# EasyEDA schematic SCH_Ouroboros-Loop-Station-rev.0.7_2025-08-07.json

## Sheets
1 Leds: TITLE: Ouroboros Looper / Leds; REV: 0.7; Date: 2025-06-13; Sheet: 2/4; Drawn By: Alex Kulinchenko; Company: WTF
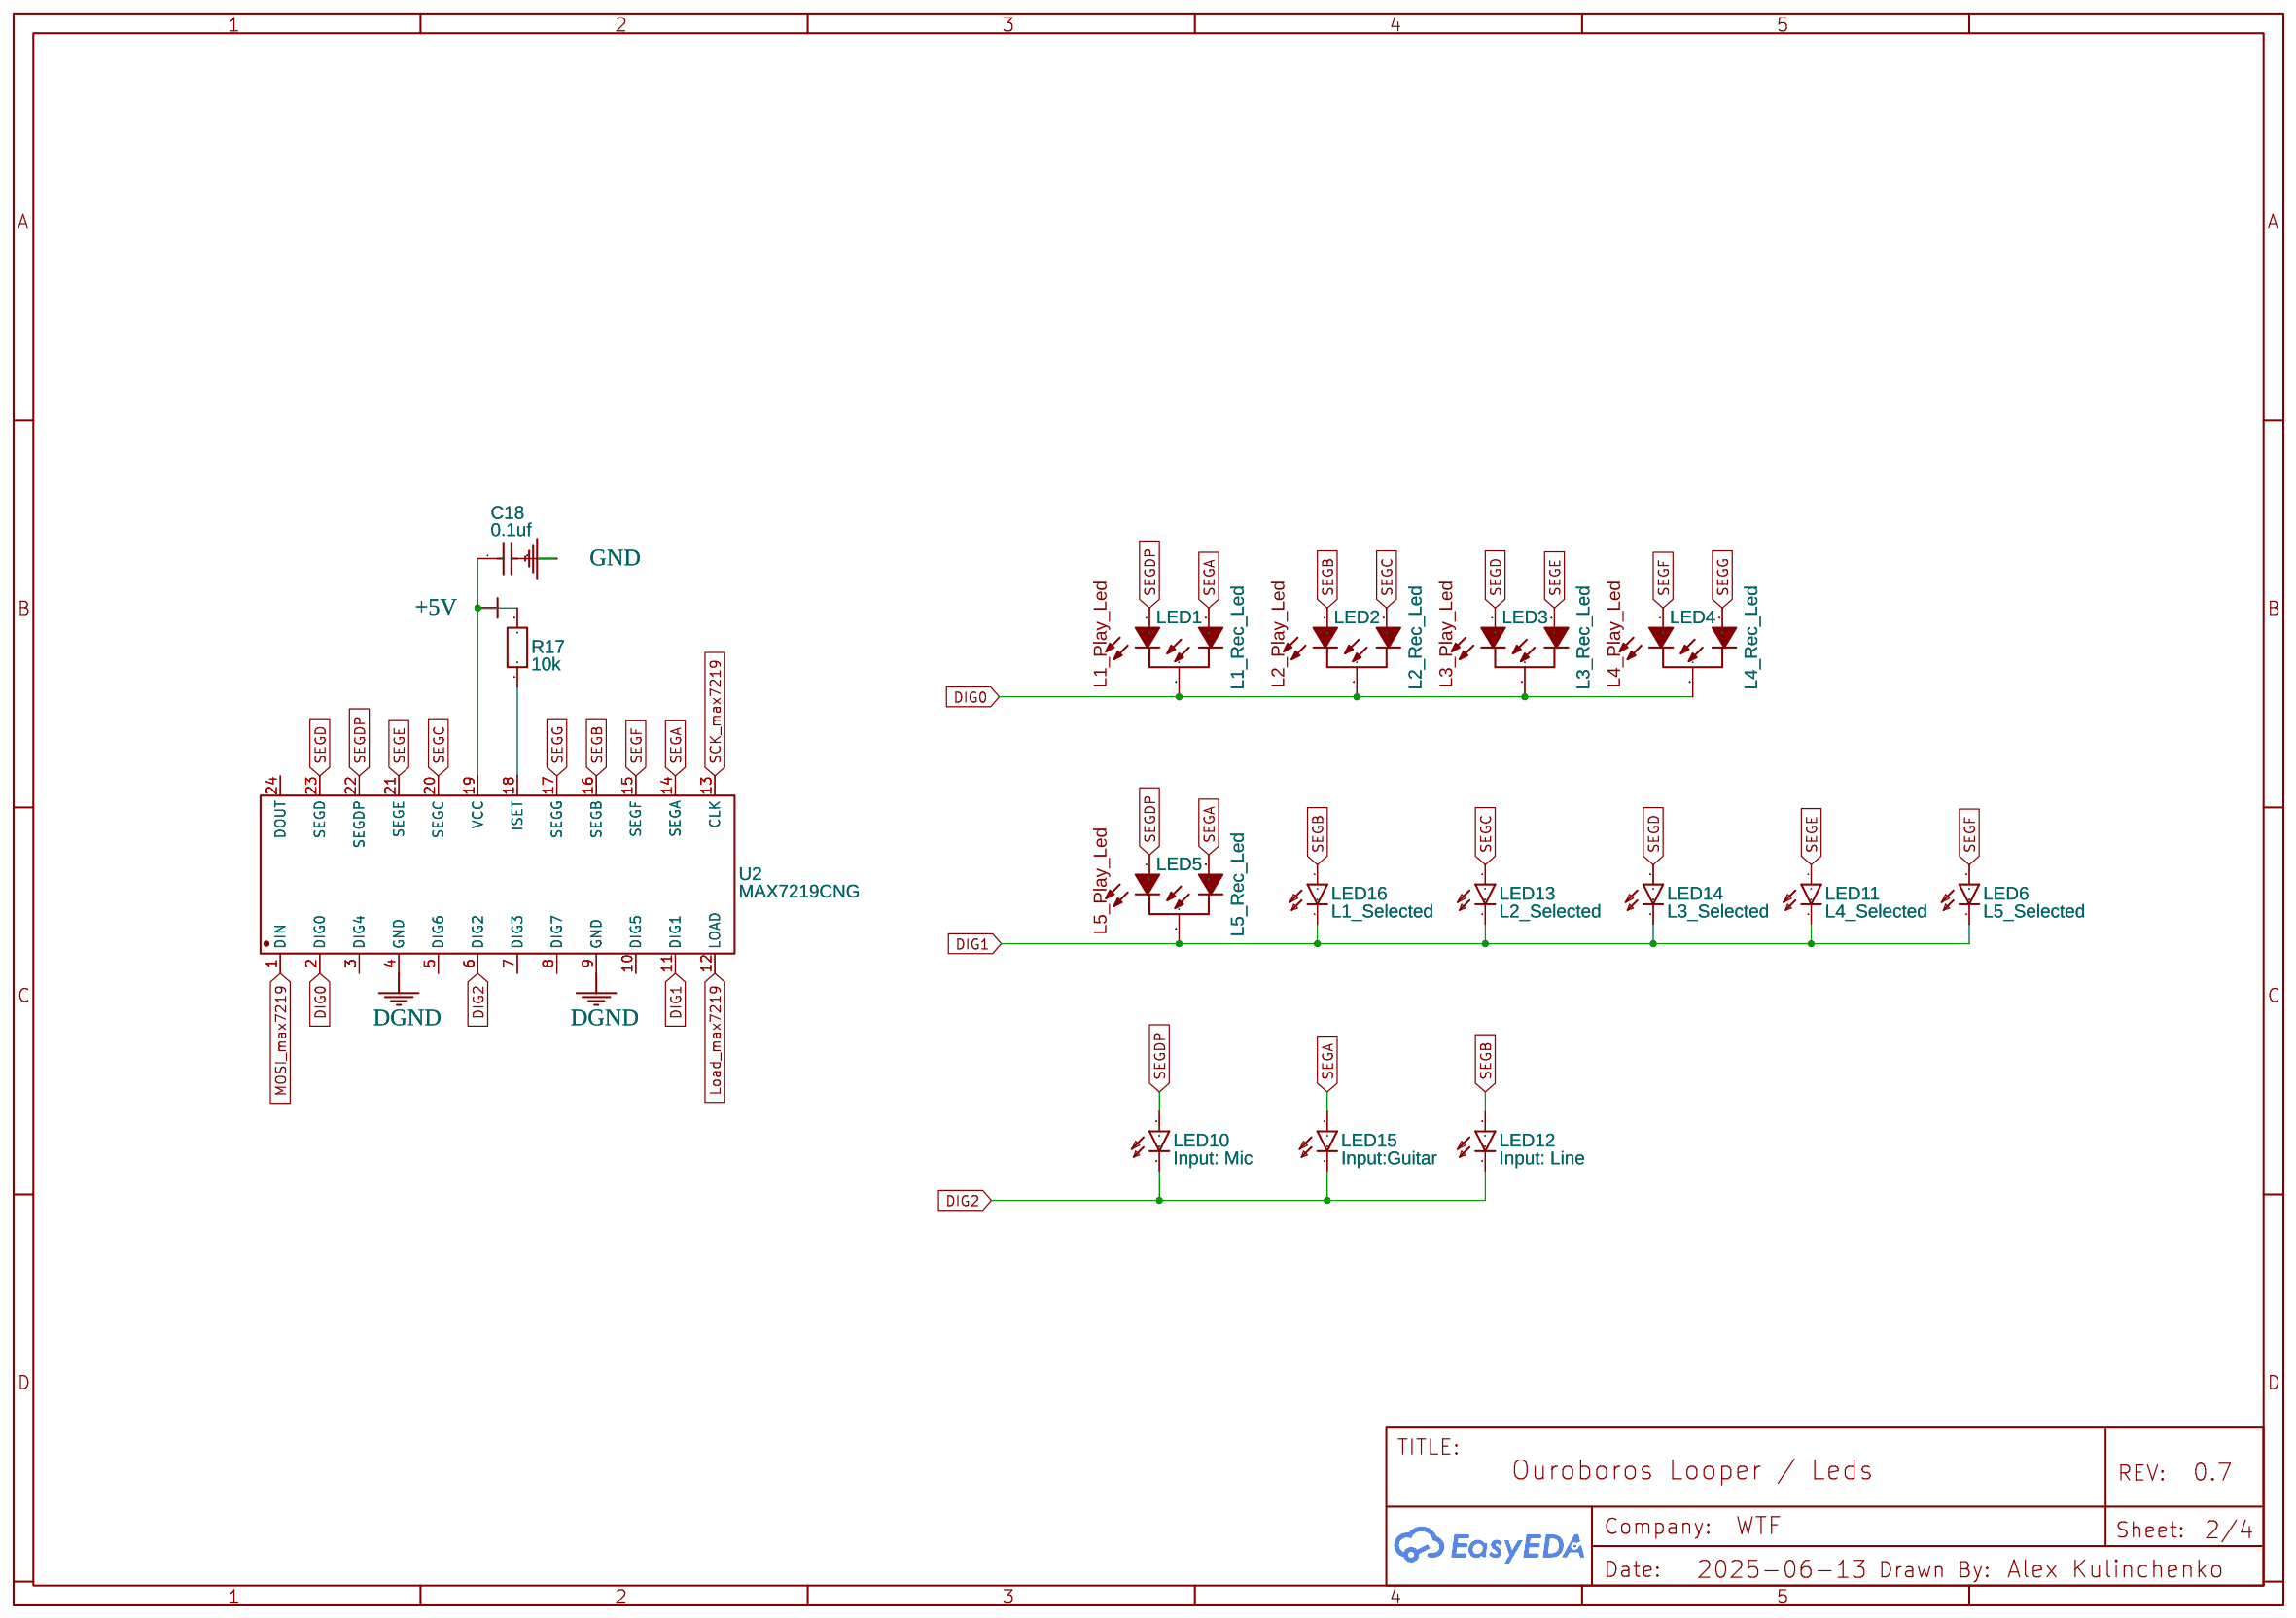
[diagram p0: Leds]
2 In&Out rev.2 copy: TITLE: Ouroboros Looper / In&Out; Date: 2025-06-05; Sheet: 1/4
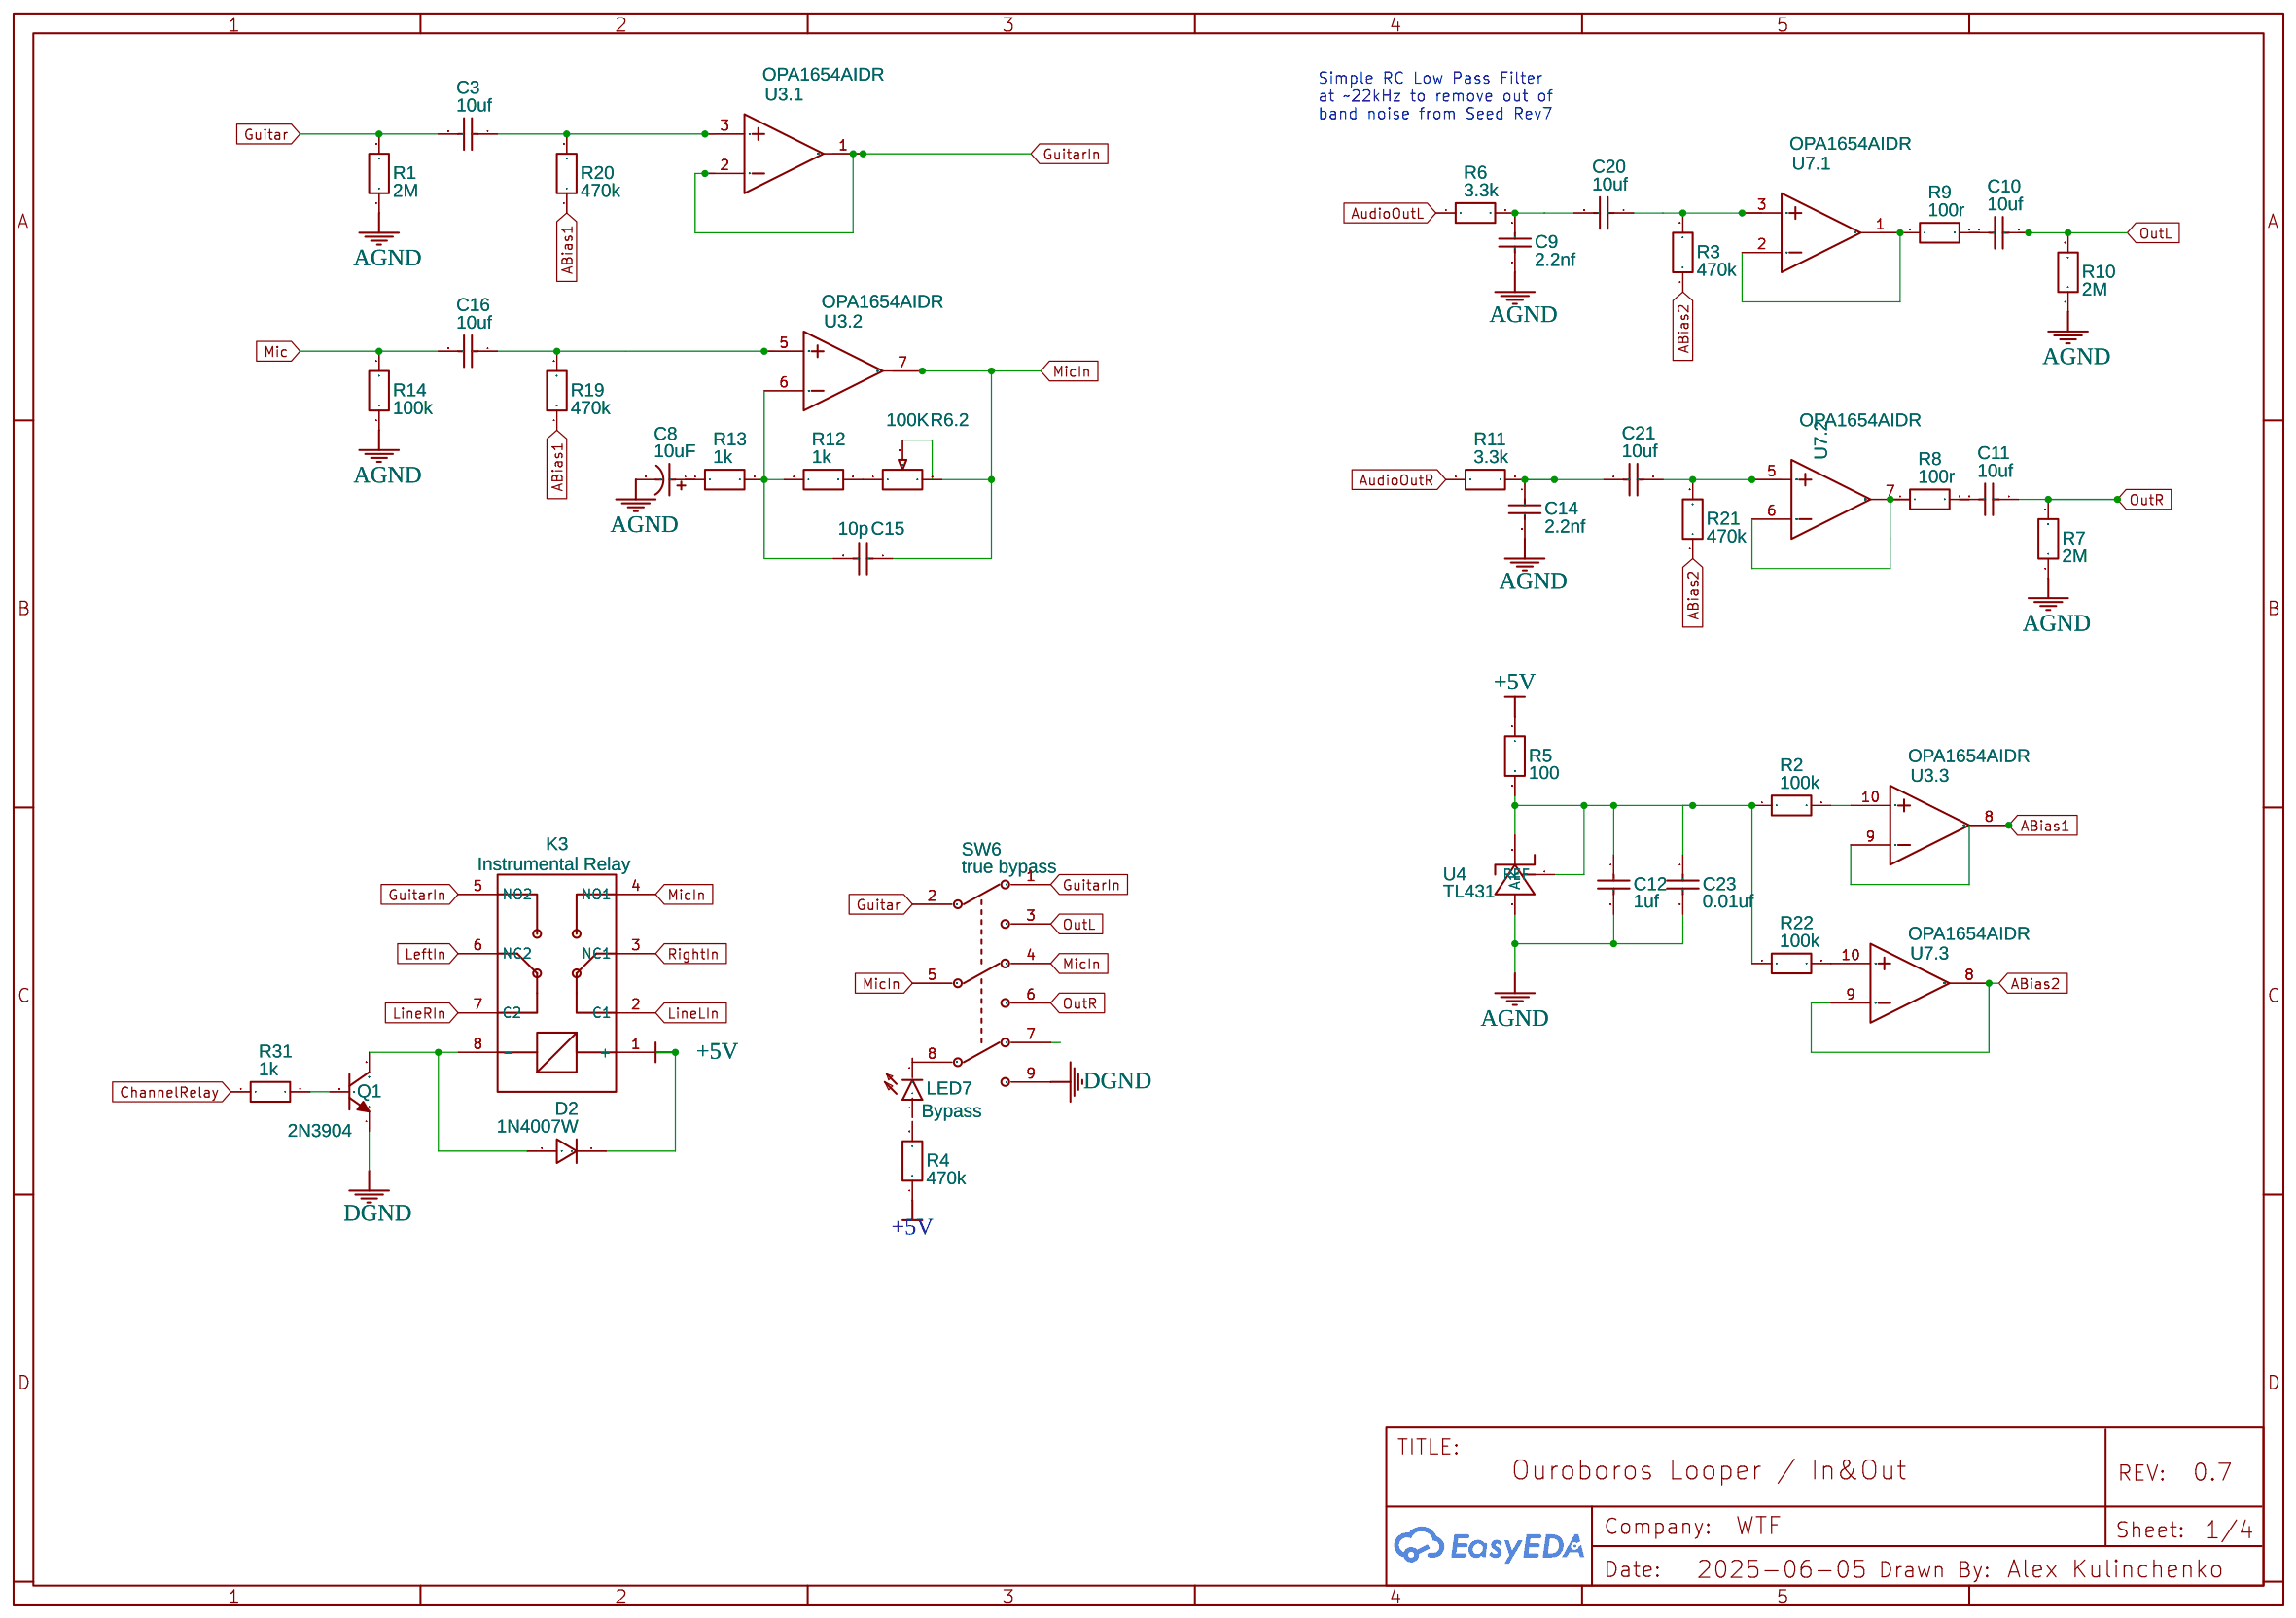
[diagram p1: In&Out rev.2 copy]
3 Main: TITLE: Ouroboros Looper / Daisy; Date: 2025-07-24; Sheet: 1/1; Drawn By: a.kulinchenko; Company: Alex Kulinchenko
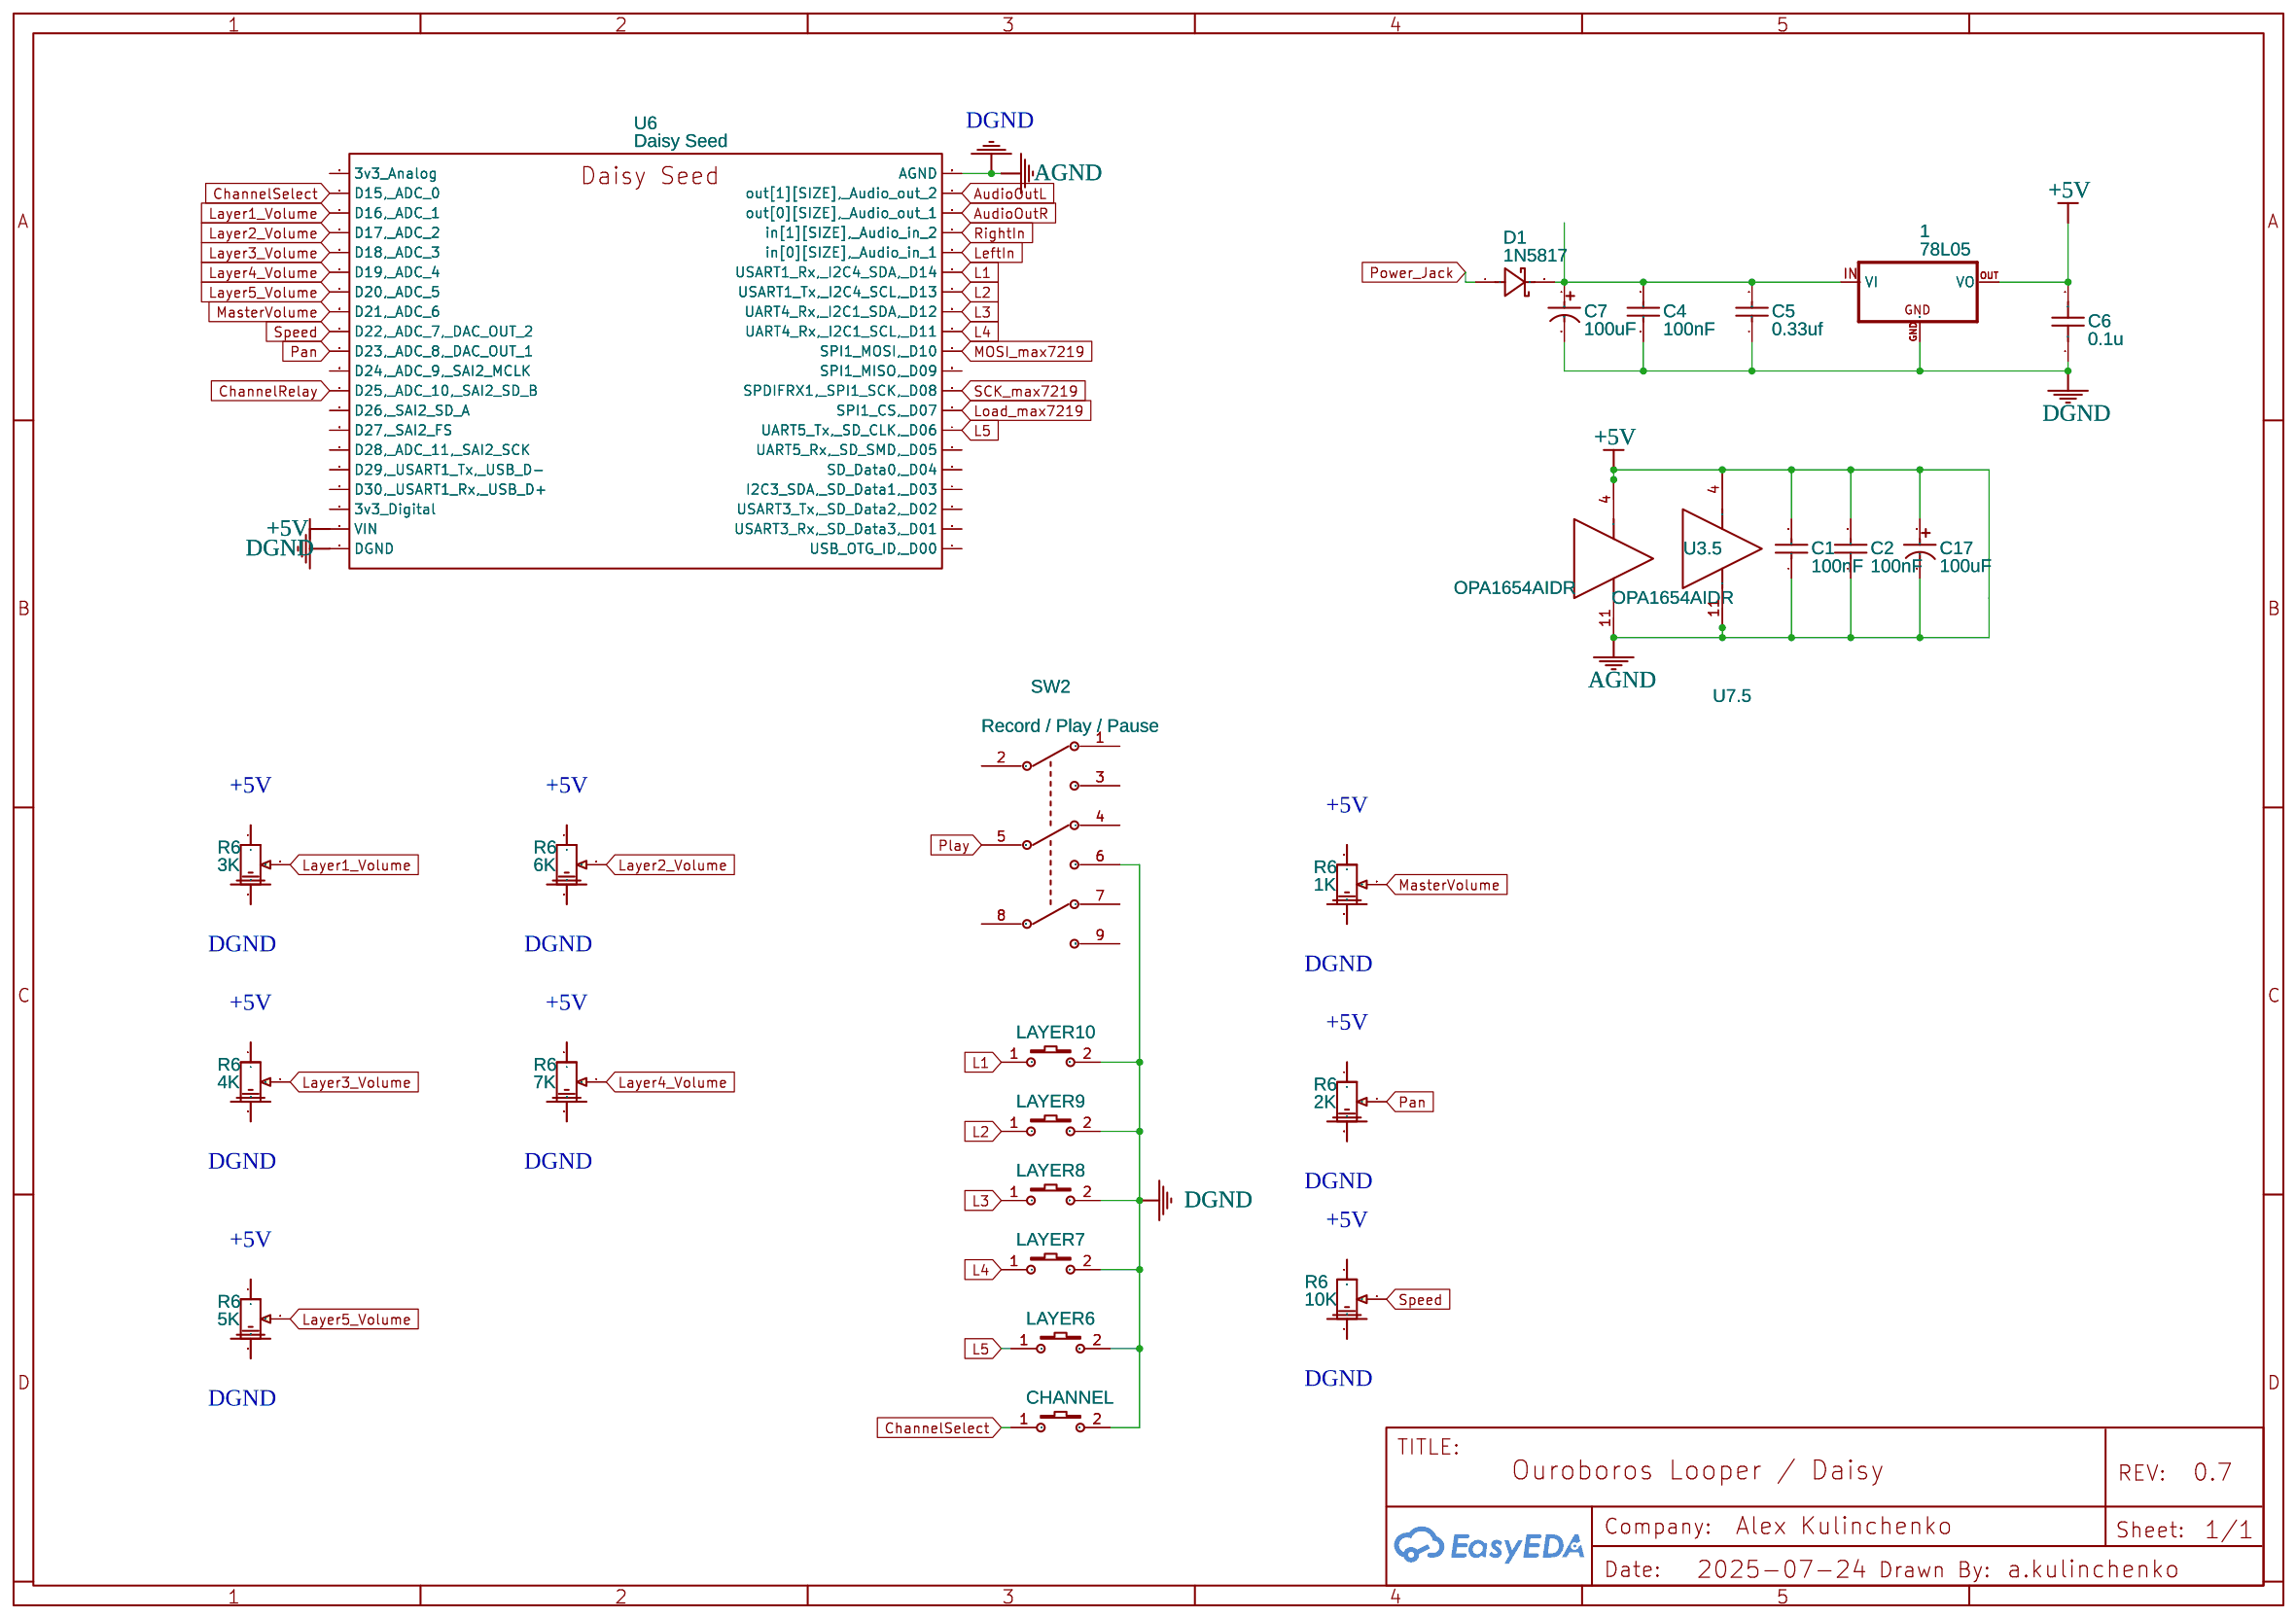
[diagram p2: Main]

## Parts
sheet In&Out rev.2 copy
100K  R6.2  [RES-ADJ-TH_3386P]
C3  10uf  [100NF]
C8  10uF  [CAP10UF SURACHAT]
C9  2.2nf  [100NF]
C10  10uf  [100NF]
C11  10uf  [100NF]
C12  1uf  [100NF]
C14  2.2nf  [100NF]
C15  10p  [100NF]
C16  10uf  [100NF]
C20  10uf  [100NF]
C21  10uf  [100NF]
C23  0.01uf  [100NF]
D2  1N4007W  [SOD-123_L2.8-W1.8-LS3.7-RD]
K3  Instrumental Relay  [G6K-2F-Y OMRON]
LED7  Bypass  [LED_LED3MM]
Q1  2N3904  [TO-92-3_L4.8-W3.7-P1.27-L]
R1  2M  [R_AXIAL-0.4]
R2  100k  [R_AXIAL-0.4]
R3  470k  [R_AXIAL-0.4]
R4  470k  [R_AXIAL-0.4]
R5  100  [R_AXIAL-0.4]
R6  3.3k  [R_AXIAL-0.4]
R7  2M  [R_AXIAL-0.4]
R8  100r  [R_AXIAL-0.4]
R9  100r  [R_AXIAL-0.4]
R10  2M  [R_AXIAL-0.4]
R11  3.3k  [R_AXIAL-0.4]
R12  1k  [R_AXIAL-0.4]
R13  1k  [R_AXIAL-0.4]
R14  100k  [R_AXIAL-0.4]
R19  470k  [R_AXIAL-0.4]
R20  470k  [R_AXIAL-0.4]
R21  470k  [R_AXIAL-0.4]
R22  100k  [R_AXIAL-0.4]
R31  1k  [R_AXIAL-0.4]
SW6  true bypass  [3PDT FOOTSWITCH]
U3  OPA1654AIDR  [SOIC-14_L8.7-W3.9-P1.27-LS6.0-BL]  (sections 1,2,3,5)
U4  TL431  [TL431]
U7  OPA1654AIDR  [SOIC-14_L8.7-W3.9-P1.27-LS6.0-BL]  (sections 1,2,3,5)
sheet Leds
C18  0.1uf  [100NF]
LED1  L1_Rec_Led  [T1(3MM) 3-PIN-RED/YELLOW COMMON CATHODE]
LED2  L2_Rec_Led  [T1(3MM) 3-PIN-RED/YELLOW COMMON CATHODE]
LED3  L3_Rec_Led  [T1(3MM) 3-PIN-RED/YELLOW COMMON CATHODE]
LED4  L4_Rec_Led  [T1(3MM) 3-PIN-RED/YELLOW COMMON CATHODE]
LED5  L5_Rec_Led  [T1(3MM) 3-PIN-RED/YELLOW COMMON CATHODE]
LED6  L5_Selected  [LED_LED3MM]
LED10  Input: Mic  [LED_LED3MM]
LED11  L4_Selected  [LED_LED3MM]
LED12  Input: Line  [LED_LED3MM]
LED13  L2_Selected  [LED_LED3MM]
LED14  L3_Selected  [LED_LED3MM]
LED15  Input:Guitar  [LED_LED3MM]
LED16  L1_Selected  [LED_LED3MM]
R17  10k  [R_AXIAL-0.4]
U2  MAX7219CNG  [MAX7219CNG]
sheet Main
1  78L05  [78L09]
1K  R6  [RES-ADJ-TH_3386P]
2K  R6  [RES-ADJ-TH_3386P]
3K  R6  [RES-ADJ-TH_3386P]
4K  R6  [RES-ADJ-TH_3386P]
5K  R6  [RES-ADJ-TH_3386P]
6K  R6  [RES-ADJ-TH_3386P]
7K  R6  [RES-ADJ-TH_3386P]
10K  R6  [RES-ADJ-TH_3386P]
C1  100nF  [100NF]
C2  100nF  [100NF]
C4  100nF  [100NF]
C5  0.33uf  [100NF]
C6  0.1u  [RAD-0.3]
C7  100uF  [CAP10UF SURACHAT]
C17  100uF  [CAP10UF SURACHAT]
CHANNEL  1  [KEY-SMD_2P-L6.2-W3.6-LS8.0]
D1  1N5817  [1N5817_THROUGH]
LAYER6  1  [KEY-SMD_2P-L6.2-W3.6-LS8.0]
LAYER7  1  [KEY-SMD_2P-L6.2-W3.6-LS8.0]
LAYER8  1  [KEY-SMD_2P-L6.2-W3.6-LS8.0]
LAYER9  1  [KEY-SMD_2P-L6.2-W3.6-LS8.0]
LAYER10  1  [KEY-SMD_2P-L6.2-W3.6-LS8.0]
SW2  Record / Play / Pause  [3PDT FOOTSWITCH]
U6  Daisy Seed  [DAISY_SEED]

## Library data of the parts
1K 2K 3K 4K 5K 6K 7K 100K = R_3386P_EU: Supplier: LCSC; Contributor: LCEDA_Lib; Value(Ω): 10K
C1-C5 C9-C12 C14-C16 C18 C20 C21 C23 = 100nF: Supplier: LCSC; Manufacturer: ReliaPro; Manufacturer Part: CT4-0805Y104M500; Contributor: LCSC; Supplier Part: C46756
C7 C8 C17 = CAP10UF SURACHAT s: Supplier: LCSC; Manufacturer Part: KM106M063D11RR0VH2FP0; Manufacturer: CX(承兴); Supplier Part: C32455; JLCPCB Part Class: Extended Part; Contributor: b.bank8533
D2 = 1N4007W: Supplier: LCSC; Supplier Part: C328592; Manufacturer: BLUE ROCKET; Contributor: LCEDA_Lib
K3 = Relay G6K-2F-Y: Manufacturer Part: G6K-2F-Y; link: https://www.google.it/url?sa=t&rct=j&q=&esrc=s&source=web&cd=2&cad=rja&uact=8&ved=0ahUKEwjBwsv5g_TYAhUG1iwKHfW_AvgQFgg3MAE&url=http%3A%2F%2Fomronfs.omron.com%2Fen_US%2Fecb%2Fproducts%2Fpdf%2Fen-g6k.pdf&usg=AOvVaw1LzdT0Fa35qPXcHpe_-UXs; Contributor: mgostinelli
LED6 LED7 LED10-LED16 = LED_LED3MM: Contributor: titiyanee.saw
Q1 = 2N3904-338: Supplier: LCSC; Supplier Part: C22751478; Manufacturer: ALJ(龙晶微); Contributor: lcsc; JLCPCB Part Class: Extended Part
R1-R14 R17 R19-R22 R31 = R_AXIAL-0.4_EU: Contributor: LCEDA_Lib
SW2 SW6 = ULT239_3PDT_SWITCH: Supplier: AliExpress; Contributor: Andro
U3 U7 = OPA1654AIDR: tags: Audio Operational Amplifier; Supplier Part: C30026; Supplier: LCSC; Manufacturer: TI; subpart_no: 1; JLCPCB Part Class: Extended Part
U4 = TL431: Manufacturer: TI; image: //image.lceda.cn/szlcsc/C23892.jpg; Contributor: ollyweg
LED1-LED5 = LED RED/YELLOW DIFFUSED T-1 T/H: Manufacturer: Kingbright; Manufacturer Part: WP3VEYW; Supplier: Digi-Key; Supplier Part: 754-1222-ND; link: https://www.digikey.com/en/products/detail/kingbright/WP3VEYW/1747621; Contributor: Claude7Quesnelle
U2 = MAX7219CNG: Contributor: FarPost
1 = 78LXX: Contributor: Lee De Forest
10K = R_3386P_EU: Supplier: LCSC; Contributor: LCEDA_Lib
C6 = C_RAD-0.3_US: Contributor: LCEDA_Lib
CHANNEL LAYER6-LAYER10 = K2-3.6×6.1_SMD: Supplier Part: C118141; Supplier: LCSC; Manufacturer Part: K2-1107ST-A4SW-06; Contributor: LCEDA_Lib; 制造商: 韩国韩荣
D1 = 1N5817: Contributor: alexdr5398
U6 = Daisy Seed: Contributor: jjmens

## Nets
+5V: 1.GND 1.OUT(VO) 1K.1 1K.3 2K.1 2K.3 3K.1 3K.3 4K.1 4K.3 5K.1 5K.3 6K.1 6K.3 7K.1 7K.3 10K.1 10K.3 C1.1 C1.2 C2.1 C2.2 C4.1 C5.1 C6.1 C6.2 C7.2 C8.2 C9.2 C12.2 C14.2 C17.1 C17.2 C18.1 C23.2 CHANNEL.2 D2.1 K3.1(+) LAYER6.2 LAYER7.2 LAYER8.2 LAYER9.2 LAYER10.2 Q1.1(E) R1.1 R4.1 R5.1 R7.1 R10.1 R14.1 R17.2 SW2.6 SW6.9 U2.4(GND) U2.9(GND) U2.19(VCC) U3.4(V+) U3.11(V-) U4.2(A) U6.20(AGND) U6.39(VIN) U6.40(DGND) U7.4(V+) U7.11(V-)
GND: C18.2
ABias1: R19.1 R20.1 U3.8(OUT C) U3.9(IN C-)
ABias2: R3.1 R21.1 U7.8(OUT C) U7.9(IN C-)
AudioOutL: R6.1 U6.19(out[1][SIZE], Audio out 2)
AudioOutR: R11.1 U6.18(out[0][SIZE], Audio out 1)
ChannelRelay: R31.1 U6.32(D25, ADC 10, SAI2 SD B)
ChannelSelect: CHANNEL.1 U6.22(D15, ADC 0)
DIG0: LED1.2(K) LED2.2(K) LED3.2(K) LED4.2(K) U2.2(DIG0)
DIG1: LED5.2(K) LED6.K(C) LED11.K(C) LED13.K(C) LED14.K(C) LED16.K(C) U2.11(DIG1)
DIG2: LED10.K(C) LED12.K(C) LED15.K(C) U2.6(DIG2)
Guitar: C3.2 R1.2 SW6.2
GuitarIn: K3.5(NO2) SW6.1 U3.1(OUT A) U3.2(IN A-)
L1: LAYER10.1 U6.15(USART1 Rx, I2C4 SDA, D14)
L2: LAYER9.1 U6.14(USART1 Tx, I2C4 SCL, D13)
L3: LAYER8.1 U6.13(UART4 Rx, I2C1 SDA, D12)
L4: LAYER7.1 U6.12(UART4 Rx, I2C1 SCL, D11)
L5: LAYER6.1 U6.7(UART5 Tx, SD CLK, D06)
Layer1_Volume: 3K.2 U6.23(D16, ADC 1)
Layer2_Volume: 6K.2 U6.24(D17, ADC 2)
Layer3_Volume: 4K.2 U6.25(D18, ADC 3)
Layer4_Volume: 7K.2 U6.26(D19, ADC 4)
Layer5_Volume: 5K.2 U6.27(D20, ADC 5)
LeftIn: K3.6(NC2) U6.16(in[0][SIZE], Audio in 1)
LineLIn: K3.2(C1)
LineRIn: K3.7(C2)
Load_max7219: U2.12(LOAD) U6.8(SPI1 CS, D07)
MasterVolume: 1K.2 U6.28(D21, ADC 6)
Mic: C16.2 R14.2
MicIn: 100K.3 C15.1 K3.4(NO1) SW6.4 SW6.5 U3.7(OUT B)
MOSI_max7219: U2.1(DIN) U6.11(SPI1 MOSI, D10)
OutL: C10.1 R10.2 SW6.3
OutR: C11.1 R7.2 SW6.6
Pan: 2K.2 U6.30(D23, ADC 8, DAC OUT 1)
Play: SW2.5
Power_Jack: D1.1
RightIn: K3.3(NC1) U6.17(in[1][SIZE], Audio in 2)
SCK_max7219: U2.13(CLK) U6.9(SPDIFRX1, SPI1 SCK, D08)
SEGA: LED1.3(R) LED5.3(R) LED15.A U2.14(SEGA)
SEGB: LED2.1(G) LED12.A LED16.A U2.16(SEGB)
SEGC: LED2.3(R) LED13.A U2.20(SEGC)
SEGD: LED3.1(G) LED14.A U2.23(SEGD)
SEGDP: LED1.1(G) LED5.1(G) LED10.A U2.22(SEGDP)
SEGE: LED3.3(R) LED11.A U2.21(SEGE)
SEGF: LED4.1(G) LED6.A U2.15(SEGF)
SEGG: LED4.3(R) U2.17(SEGG)
Speed: 10K.2 U6.29(D22, ADC 7, DAC OUT 2)
Net-(1-IN): 1.IN(VI) C4.2 C5.2 C7.1 D1.2
Net-(100K-1): 100K.1 R12.2
Net-(C3-1): C3.1 R20.2 U3.3(IN A+)
Net-(C9-1): C9.1 C20.2 R6.2
Net-(C11-2): C11.2 R8.2
Net-(C12-1): C12.1 C23.1 R2.1 R5.2 R22.1 U4.1(REF) U4.3(K)
Net-(C14-1): C14.1 C21.2 R11.2
Net-(C15-2): C15.2 R12.1 R13.2 U3.6(IN B-)
Net-(C16-1): C16.1 R19.2 U3.5(IN B+)
Net-(C20-1): C20.1 R3.2 U7.3(IN A+)
Net-(C21-1): C21.1 R21.2 U7.5(IN B+)
Net-(D2-2): D2.2 K3.8(-) Q1.3(C)
Net-(Q1-2): Q1.2(B) R31.2
Net-(R2-2): R2.2 U3.10(IN C+)
Net-(R8-1): R8.1 U7.6(IN B-)
Net-(R9-1): R9.1 U7.1(OUT A) U7.2(IN A-)
Net-(R17-1): R17.1 U2.18(ISET)
Net-(R22-2): R22.2 U7.10(IN C+)

Not connected (* = marked no-connect by the designer): 100K 2; C8 1; C10 2; LED7 A K(C); R4 2; R9 2; R13 1; SW2 1 2 3 4 7 8 9; SW6 7 8; U2 3(DIG4) 5(DIG6) 7(DIG3) 8(DIG7) 10(DIG5) 24(DOUT); U6 1(USB OTG ID, D00) 2(USART3 Rx, SD Data3, D01) 3(USART3 Tx, SD Data2, D02) 4(I2C3 SDA, SD Data1, D03) 5(SD Data0, D04) 6(UART5 Rx, SD SMD, D05) 10(SPI1 MISO, D09) 21(3v3 Analog) 31(D24, ADC 9, SAI2 MCLK) 33(D26, SAI2 SD A) 34(D27, SAI2 FS) 35(D28, ADC 11, SAI2 SCK) 36(D29, USART1 Tx, USB D-) 37(D30, USART1 Rx, USB D+) 38(3v3 Digital); U7 7(OUT B)

## Notes on the sheets
sheet 2
- Simple RC Low Pass Filter
  at ~22kHz to remove out of
  band noise from Seed Rev7
